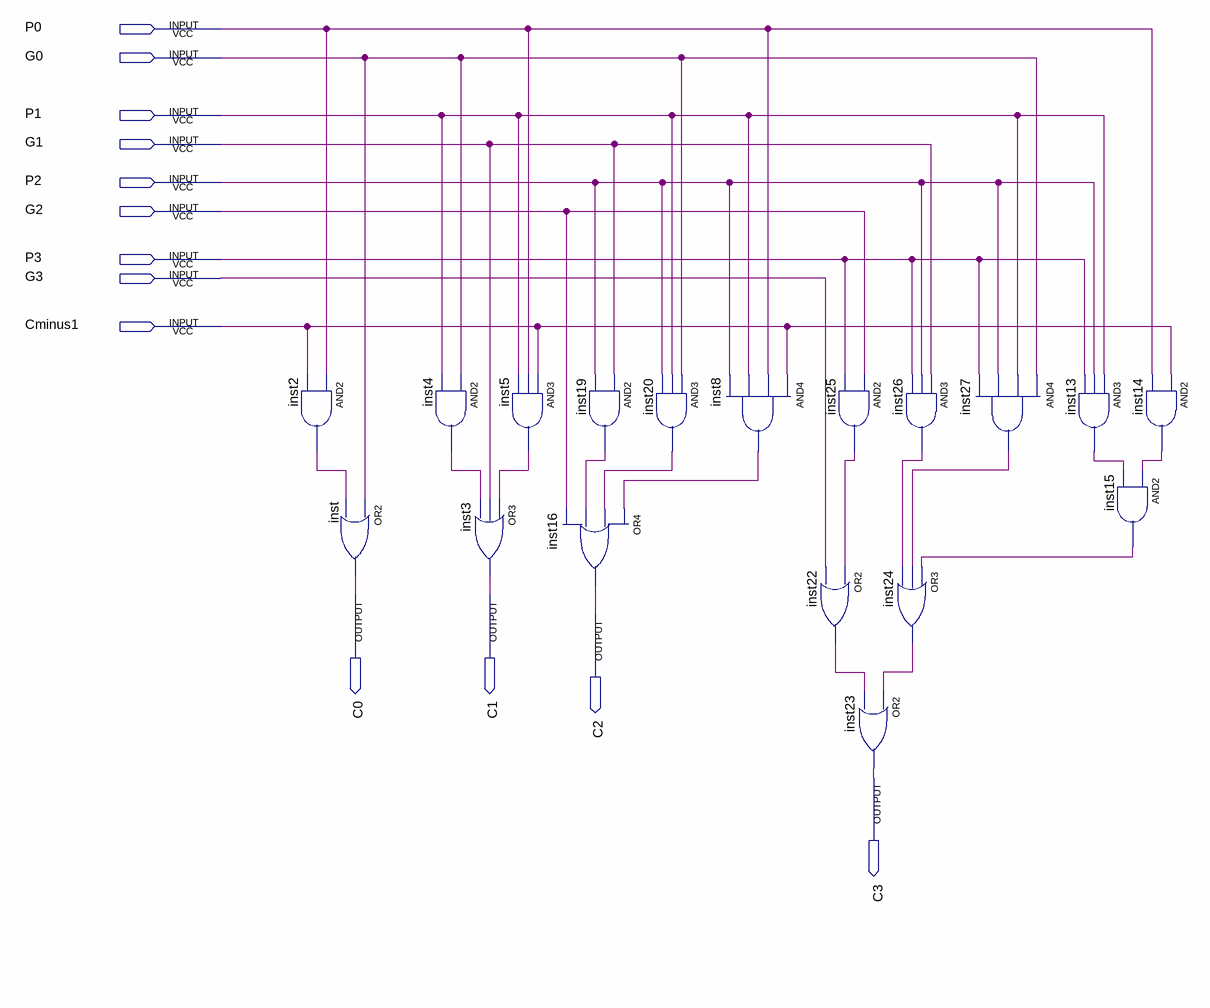
[diagram p0: schematic sheet]
// Quartus schematic fourbitadder.bdf as structural Verilog: 18 symbols, 13 pins
module fourbitadder (
  input  P0,
  input  G0,
  input  P1,
  input  G1,
  input  P2,
  input  G2,
  input  P3,
  input  G3,
  input  Cminus1,
  output C0,
  output C1,
  output C2,
  output C3
);

  wire inst2_out, inst4_out, inst5_out, inst8_out, inst13_out, inst14_out, inst15_out, inst19_out,
       inst20_out, inst22_out, inst24_out, inst25_out, inst26_out, inst27_out;

  and inst2 (inst2_out, P0, Cminus1);
  or inst (C0, G0, inst2_out);
  and inst4 (inst4_out, G0, P1);
  or inst3 (C1, inst5_out, G1, inst4_out);
  and inst5 (inst5_out, Cminus1, P0, P1);
  or inst16 (C2, inst8_out, inst20_out, inst19_out, G2);
  and inst19 (inst19_out, G1, P2);
  and inst20 (inst20_out, G0, P1, P2);
  and inst8 (inst8_out, Cminus1, P0, P1, P2);
  and inst25 (inst25_out, G2, P3);
  or inst22 (inst22_out, inst25_out, G3);
  or inst23 (C3, inst24_out, inst22_out);
  and inst26 (inst26_out, G1, P2, P3);
  or inst24 (inst24_out, inst15_out, inst27_out, inst26_out);
  and inst27 (inst27_out, G0, P1, P2, P3);
  and inst13 (inst13_out, P1, P2, P3);
  and inst14 (inst14_out, Cminus1, P0);
  and inst15 (inst15_out, inst14_out, inst13_out);
endmodule
